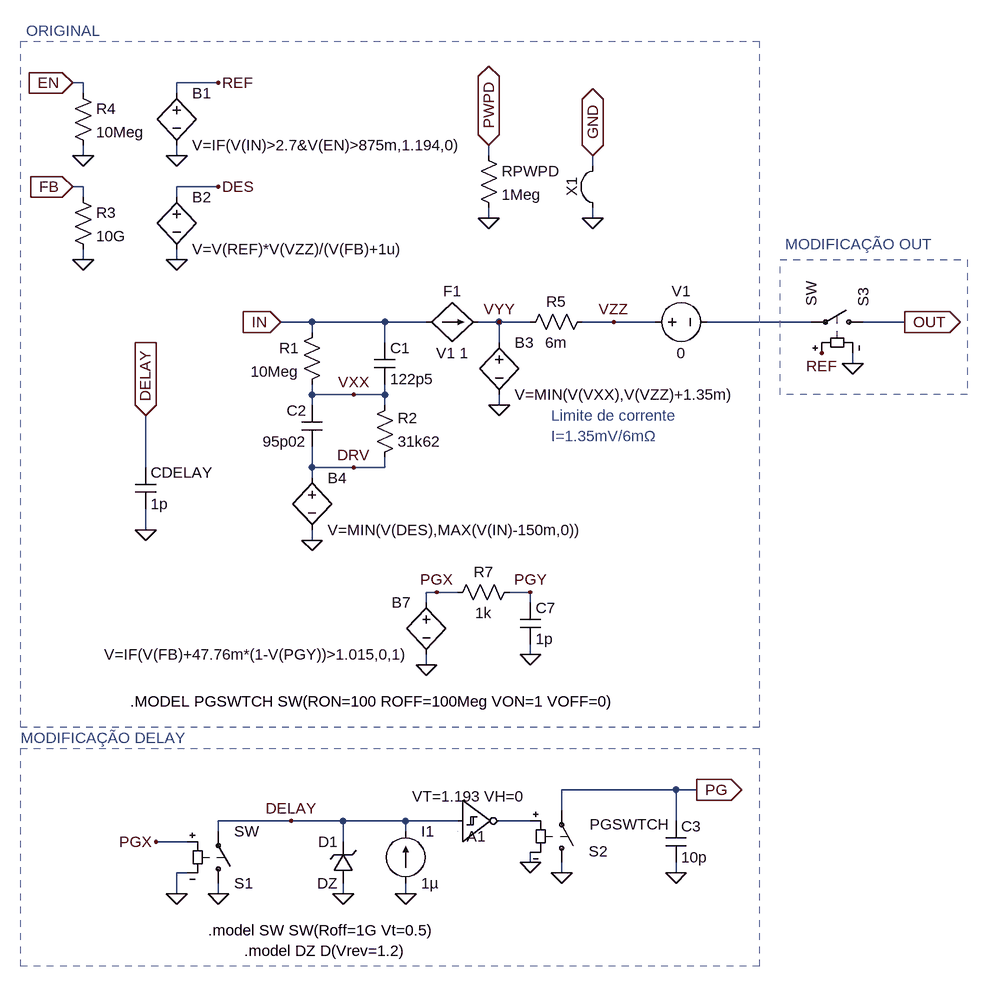
[diagram p0: schematic TPS7A1601.asc]
TPS7A1601.asc, the LTspice schematic file:
Version 4
SHEET 1 1412 1256
WIRE -16 -288 -32 -288
WIRE 192 -288 128 -288
WIRE -16 -272 -16 -288
WIRE 128 -272 128 -288
WIRE -16 -176 -16 -192
WIRE 128 -176 128 -192
WIRE 608 -176 608 -192
WIRE 768 -160 768 -176
WIRE -16 -128 -32 -128
WIRE 192 -128 128 -128
WIRE -16 -112 -16 -128
WIRE 128 -112 128 -128
WIRE 608 -80 608 -96
WIRE 768 -80 768 -96
WIRE -16 -16 -16 -32
WIRE 128 -16 128 -32
WIRE 336 80 288 80
WIRE 448 80 336 80
WIRE 512 80 448 80
WIRE 624 80 592 80
WIRE 672 80 624 80
WIRE 800 80 752 80
WIRE 864 80 800 80
WIRE 1104 80 944 80
WIRE 1248 80 1184 80
WIRE 336 96 336 80
WIRE 448 112 448 80
WIRE 624 112 624 80
WIRE 1168 144 1168 128
WIRE 336 192 336 176
WIRE 400 192 336 192
WIRE 448 192 448 176
WIRE 448 192 400 192
WIRE 336 208 336 192
WIRE 448 208 448 192
WIRE 624 208 624 192
WIRE 80 304 80 224
WIRE 336 304 336 272
WIRE 400 304 336 304
WIRE 448 304 448 288
WIRE 448 304 400 304
WIRE 336 320 336 304
WIRE 80 400 80 368
WIRE 336 416 336 400
WIRE 528 496 512 496
WIRE 560 496 528 496
WIRE 672 496 640 496
WIRE 512 512 512 496
WIRE 672 512 672 496
WIRE 672 592 672 576
WIRE 512 608 512 592
WIRE 896 800 720 800
WIRE 928 800 896 800
WIRE 720 832 720 800
WIRE 304 848 192 848
WIRE 384 848 304 848
WIRE 480 848 384 848
WIRE 560 848 480 848
WIRE 672 848 624 848
WIRE 896 848 896 800
WIRE 192 864 192 848
WIRE 480 864 480 848
WIRE 144 880 96 880
WIRE 384 880 384 848
WIRE 672 912 672 896
WIRE 144 928 128 928
WIRE 720 928 720 912
WIRE 896 928 896 912
WIRE 128 960 128 928
WIRE 192 960 192 944
WIRE 384 960 384 944
WIRE 480 960 480 944
FLAG 80 224 DELAY
IOPIN 80 224 In
FLAG 80 400 0
FLAG 288 80 IN
IOPIN 288 80 In
FLAG 400 304 DRV
FLAG 400 192 VXX
FLAG 1248 80 OUT
IOPIN 1248 80 Out
FLAG 800 80 VZZ
FLAG 624 208 0
FLAG 128 -16 0
FLAG 192 -128 DES
FLAG 128 -176 0
FLAG 192 -288 REF
FLAG 336 416 0
FLAG 672 496 PGY
FLAG 624 80 VYY
FLAG 512 608 0
FLAG 528 496 PGX
FLAG 672 592 0
FLAG -32 -128 FB
IOPIN -32 -128 In
FLAG 608 -80 0
FLAG 608 -192 PWPD
IOPIN 608 -192 BiDir
FLAG -16 -16 0
FLAG -32 -288 EN
IOPIN -32 -288 In
FLAG -16 -176 0
FLAG 768 -80 0
FLAG 768 -176 GND
IOPIN 768 -176 BiDir
FLAG 480 960 0
FLAG 192 960 0
FLAG 128 960 0
FLAG 384 960 0
FLAG 928 800 PG
IOPIN 928 800 Out
FLAG 720 928 0
FLAG 304 848 DELAY
FLAG 96 880 PGX
FLAG 672 912 0
FLAG 1120 128 REF
FLAG 1168 144 0
FLAG 896 928 0
SYMBOL cap 64 304 R0
SYMATTR InstName CDELAY
SYMATTR Value 1p
SYMBOL res 352 80 M0
SYMATTR InstName R1
SYMATTR Value 10Meg
SYMBOL cap 432 112 R0
SYMATTR InstName C1
SYMATTR Value 122p5
SYMBOL res 432 304 M180
WINDOW 0 36 76 Left 2
WINDOW 3 36 40 Left 2
SYMATTR InstName R2
SYMATTR Value 31k62
SYMBOL cap 352 272 R180
WINDOW 0 24 56 Left 2
WINDOW 3 24 8 Left 2
SYMATTR InstName C2
SYMATTR Value 95p02
SYMBOL voltage 848 80 R270
WINDOW 0 32 56 VTop 2
WINDOW 3 -32 56 VBottom 2
SYMATTR InstName V1
SYMATTR Value 0
SYMBOL res 656 96 R270
WINDOW 0 32 56 VTop 2
WINDOW 3 0 56 VBottom 2
SYMATTR InstName R5
SYMATTR Value 6m
SYMBOL bv 128 -288 R0
SYMATTR InstName B1
SYMATTR Value V=IF(V(IN)>2.7&V(EN)>875m,1.194,0)
SYMBOL bv 128 -128 R0
SYMATTR InstName B2
SYMATTR Value V=V(REF)*V(VZZ)/(V(FB)+1u)
SYMBOL bv 624 96 R0
SYMATTR InstName B3
SYMATTR Value V=MIN(V(VXX),V(VZZ)+1.35m)
SYMBOL bv 336 304 R0
SYMATTR InstName B4
SYMATTR Value V=MIN(V(DES),MAX(V(IN)-150m,0))
SYMBOL bv 512 496 M0
SYMATTR InstName B7
SYMATTR Value V=IF(V(FB)+47.76m*(1-V(PGY))>1.015,0,1)
SYMBOL res 544 512 R270
WINDOW 0 32 56 VTop 2
WINDOW 3 0 56 VBottom 2
SYMATTR InstName R7
SYMATTR Value 1k
SYMBOL cap 656 512 R0
SYMATTR InstName C7
SYMATTR Value 1p
SYMBOL res 592 -192 R0
SYMATTR InstName RPWPD
SYMATTR Value 1Meg
SYMBOL res -32 -128 R0
SYMATTR InstName R3
SYMATTR Value 10G
SYMBOL res -32 -288 R0
SYMATTR InstName R4
SYMATTR Value 10Meg
SYMBOL f 512 80 R270
WINDOW 0 32 40 VTop 2
WINDOW 3 -32 40 VBottom 2
SYMATTR InstName F1
SYMATTR Value V1 1
SYMBOL Misc\\jumper 704 -128 R270
SYMATTR InstName X1
SYMBOL current 480 944 M180
WINDOW 0 24 80 Left 2
WINDOW 3 24 0 Left 2
WINDOW 123 0 0 Left 0
WINDOW 39 0 0 Left 0
SYMATTR InstName I1
SYMATTR Value 1µ
SYMBOL sw 192 960 M180
SYMATTR InstName S1
SYMBOL zener 400 944 R180
WINDOW 0 24 64 Left 2
WINDOW 3 24 0 Left 2
SYMATTR InstName D1
SYMATTR Value DZ
SYMATTR Description Diode
SYMATTR Type diode
SYMBOL sw 720 928 M180
WINDOW 0 42 33 Left 2
WINDOW 3 43 75 Left 2
SYMATTR InstName S2
SYMATTR Value PGSWTCH
SYMBOL Digital\\schmtinv 560 784 R0
WINDOW 0 14 88 Left 2
WINDOW 3 -70 26 Left 2
SYMATTR InstName A1
SYMATTR Value VT=1.193 VH=0
SYMBOL sw 1200 80 M270
SYMATTR InstName S3
SYMBOL cap 880 848 R0
SYMATTR InstName C3
SYMATTR Value 10p
TEXT 56 664 Left 2 !.MODEL PGSWTCH SW(RON=100 ROFF=100Meg VON=1 VOFF=0)
TEXT 704 224 Left 2 ;Limite de corrente\nI=1.35mV/6mΩ
TEXT -104 -368 Left 2 ;ORIGINAL
TEXT 176 1016 Left 2 !.model SW SW(Roff=1G Vt=0.5)
TEXT 232 1048 Left 2 !.model DZ D(Vrev=1.2)
TEXT -112 720 Left 2 ;MODIFICAÇÃO DELAY
TEXT 1064 -40 Left 2 ;MODIFICAÇÃO OUT
RECTANGLE Normal 1024 704 -112 -352 2
RECTANGLE Normal 1024 1072 -112 736 2
RECTANGLE Normal 1344 192 1056 -16 2

The netlist it stands for:
* TPS7A1601.asc
CDELAY DELAY 0 1p
R1 IN VXX 10Meg
C1 IN VXX 122p5
R2 DRV VXX 31k62
C2 DRV VXX 95p02
V1 VZZ N001 0
R5 VYY VZZ 6m
B1 REF 0 V=IF(V(IN)>2.7&V(EN)>875m,1.194,0)
B2 DES 0 V=V(REF)*V(VZZ)/(V(FB)+1u)
B3 VYY 0 V=MIN(V(VXX),V(VZZ)+1.35m)
B4 DRV 0 V=MIN(V(DES),MAX(V(IN)-150m,0))
B7 PGX 0 V=IF(V(FB)+47.76m*(1-V(PGY))>1.015,0,1)
R7 PGX PGY 1k
C7 PGY 0 1p
RPWPD PWPD 0 1Meg
R3 FB 0 10G
R4 EN 0 10Meg
F1 IN VYY V1 1
I1 0 DELAY 1µ
S1 0 DELAY PGX 0 SW
D1 0 DELAY DZ
S2 0 PG N002 0 PGSWTCH
A1 DELAY 0 0 0 0 N002 0 0 SCHMITT VT=1.193 VH=0
S3 OUT N001 REF 0 SW
C3 PG 0 10p
.model D D
.lib standard.dio
.MODEL PGSWTCH SW(RON=100 ROFF=100Meg VON=1 VOFF=0)
* Limite de corrente
* I=1.35mV/6mΩ
* ORIGINAL
.model SW SW(Roff=1G Vt=0.5)
.model DZ D(Vrev=1.2)
* MODIFICAÇÃO DELAY
* MODIFICAÇÃO OUT
.backanno
.end